# EAGLE design light (EAGLE 7.2.0)
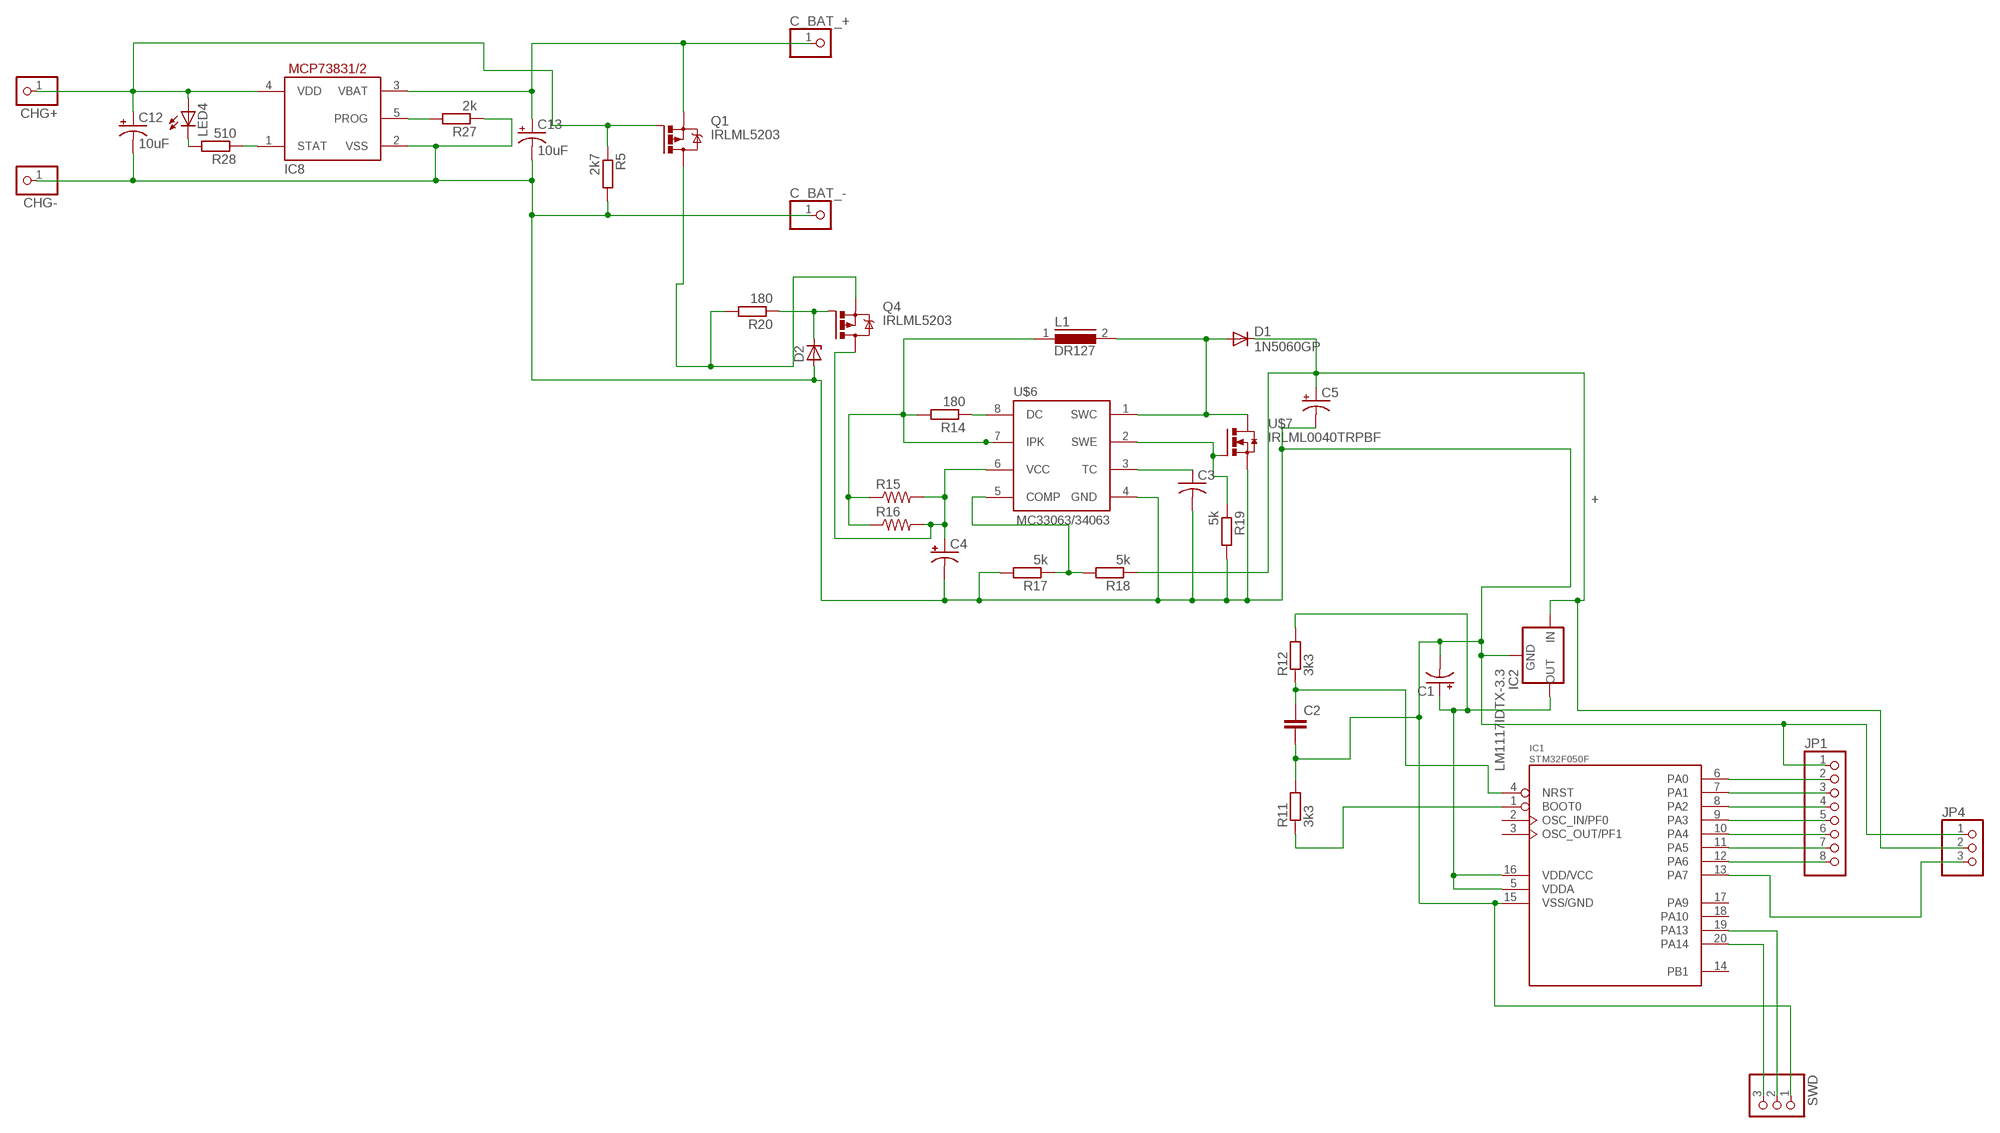
[diagram p0: schematic, sheet 1]

## Parts
C1  CPOL-USSMCD  [SMC_D]
C2  C-EUC1206  [C1206]
C3  C-US050-024X044  [C050-024X044]
C4  CPOL-USE5-8.5  [E5-8,5]
C5  CPOL-USE5-8.5  [E5-8,5]
C12  10uF  CPOL-USSMCD  [SMC_D]
C13  10uF  CPOL-USSMCD  [SMC_D]
C_BAT_+  PINHD-1X1  [1X01]
C_BAT_-  PINHD-1X1  [1X01]
CHG+  PINHD-1X1  [1X01]
CHG-  PINHD-1X1  [1X01]
D1  1N5060GP  [DO15-12]
D2  ZENER-DIODESOD80C  [SOD80C]
IC1  STM32F050F  [TSSOP20]
IC2  LM1117IDTX-3.3  [TO252]
IC8  MCP73831/OT  [SOT23-5L]
JP1  PINHD-1X8  [1X08]
JP4  PINHD-1X3  [1X03]
L1  DR127  [DR127]
LED4  LED  [SMARTLED-TTW]
Q1  IRLML5203  [MICRO3]
Q4  IRLML5203  [MICRO3]
R5  2k7  R-EU_M1206  [M1206]
R11  3k3  R-EU_M1206  [M1206]
R12  3k3  R-EU_M1206  [M1206]
R14  180  R-EU_M1206  [M1206]
R15  R-US_0207/12  [0207/12]
R16  R-US_0207/12  [0207/12]
R17  5k  R-EU_M1206  [M1206]
R18  5k  R-EU_M1206  [M1206]
R19  5k  R-EU_M1206  [M1206]
R20  180  R-EU_M1206  [M1206]
R27  2k  R-EU_M1206  [M1206]
R28  510  R-EU_M1206  [M1206]
SWD  PINHD-1X3  [1X03]
U$6  MC33063/MC34063D  [SO08]
U$7  IRLML0040TRPBF  [MICRO3]

## Nets
N$1: IC1.6(PA0) JP1.2
N$2: C1.- C2.2 C3.2 C4.- C5.- C12.- C13.- C_BAT_-.1 CHG-.1 D2.A IC1.15(VSS/GND) IC2.1(GND) IC8.2(VSS) JP1.1 JP4.1 R5.2 R11.2 R17.2 R19.2 R27.1 SWD.1 U$6.4(GND) U$7.2(S)
N$3: IC1.7(PA1) JP1.3
N$4: IC1.8(PA2) JP1.4
N$5: Q1.3(D) Q4.2(S) R20.2
N$6: IC1.9(PA3) JP1.5
N$7: IC1.10(PA4) JP1.6
N$8: IC1.11(PA5) JP1.7
N$9: IC1.12(PA6) JP1.8
N$10: IC1.13(PA7) JP4.3
N$30: L1.1 R14.2 R15.1 R16.1 U$6.7(IPK)
N$31: C2.1 IC1.4(NRST) R12.1
N$32: IC1.1(BOOT0) R11.1
N$33: D1.A L1.2 U$6.1(SWC) U$7.3(D)
N$34: IC1.19(PA13) SWD.2
N$35: IC1.20(PA14) SWD.3
N$36: R14.1 U$6.8(DC)
N$38: C4.+ Q4.3(D) R15.2 R16.2 U$6.6(VCC)
N$40: C1.+ IC1.5(VDDA) IC1.16(VDD/VCC) IC2.TAB(OUT) R12.2
N$42: C3.1 U$6.3(TC)
N$44: D2.C Q4.1(G) R20.1
N$47: R17.1 R18.2 U$6.5(COMP)
N$49: R19.1 U$6.2(SWE) U$7.1(G)
N$57: C12.+ CHG+.1 IC8.4(VDD) LED4.A@1(A) Q1.1(G) R5.1
N$66: IC8.5(PROG) R27.2
N$68: IC8.1(STAT) R28.1
N$70: LED4.C@1(C) R28.2
N$71: C13.+ C_BAT_+.1 IC8.3(VBAT) Q1.2(S)
N$73: C5.+ D1.C IC2.2(IN) JP4.2 R18.1
Unconnected: IC1.2(OSC_IN/PF0) IC1.3(OSC_OUT/PF1) IC1.14(PB1) IC1.17(PA9) IC1.18(PA10)

## Notes on the sheet
- +

## Library data of the parts
C1 C12 C13 = rcl:CPOL-US: POLARIZED CAPACITOR, American symbol
C2 = rcl:C-EU: CAPACITOR, European symbol
C3 = adafruit:C-US: CAPACITOR, American symbol
C4 C5 = adafruit:CPOL-US: POLARIZED CAPACITOR, American symbol
C_BAT_+ C_BAT_- CHG+ CHG- = adafruit:PINHD-1X1: Pin header 1x1 for 0.1" spacing With round pins
D1 = diode:1N5060GP: DIODE controlled avalanche rectifier
D2 = diode:ZENER-DIODE: Z-Diode
IC1 = STM32F050:STM32F050*: STM32F050xxF*
IC2 = lm1117:LM1117IDTX-*
IC8 = adafruit:MCP73831: MCP73831/2 Miniature Single-Cell, Fully Integrated Li-Ion, Li-Polymer Charge Management Controllers. Nice and small simple lipoly charge controller, with adjustable current and status output (LED) http://www.ladyada.net/library/pcb/eaglelibrary.html
JP1 = pinhead:PINHD-1X8: PIN HEADER
JP4 = pinhead:PINHD-1X3: PIN HEADER
L1 = inductors:DR127: High Power Density, High Efficiency, Shielded Inductors Source: coiltronics_dr_series.pdf
LED4 = adafruit:LED: LED OSRAM: - CHIPLED LG R971, LG N971, LY N971, LG Q971, LY Q971, LO R971, LY R971 LH N974, LH R974 LS Q976, LO Q976, LY Q976 LO Q996 - Hyper CHIPLED LW Q18S LB Q993, LB Q99A, LB R99A - SideLED LS A670, LO A670, LY A670, LG A670, LP A670 LB A673, LV A673, LT A673, LW A673 LH A674 LY A675 LS A676, LA A676, LO A676, LY A676, LW A676 LS A679, LY A679, LG A679 - Hyper Micro SIDELED® LS Y876, LA Y876, LO Y876, LY Y876 LT Y87S - SmartLED LW L88C, LW L88S LB L89C, LB L89S, LG L890 LS L89K, LO L89K, LY L89K LS L896, LA L896, LO L896, LY L896 - TOPLED LS T670, LO T670, LY T670, LG T670, LP T670 LSG T670, LSP T670, LSY T670, LOP T670, LYG T670 LG T671, LOG T671, LSG T671 LB T673, LV T673, LT T673, LW T673 LH T674 LS T676, LA T676, LO T676, LY T676, LB T676, LH T676, LSB T676, LW T676 LB T67C, LV T67C, LT T67C, LS T67K, LO T67K, LY T67K, LW E67C LS E67B, LA E67B, LO E67B, LY E67B, LB E67C, LV E67C, LT E67C LW T67C LS T679, LY T679, LG T679 LS T770, LO T770, LY T770, LG T770, LP T770 LB T773, LV T773, LT T773, LW T773 LH T774 LS E675, LA E675, LY E675, LS T675 LS T776, LA T776, LO T776, LY T776, LB T776 LHGB T686 LT T68C, LB T68C - Hyper Mini TOPLED® LB M676 - Mini TOPLED Santana® LG M470 LS M47K, LO M47K, LY M47K Source: http://www.osram.convergy.de/
Q1 Q4 = transistor-power:IRLML5203: HEXFET P-Channel Power MOSFET
R5 R11 R12 R14 R17-R20 R27 R28 = resistor:R-EU_: RESISTOR, European symbol
R15 R16 = adafruit:R-US_: RESISTOR, American symbol
SWD = adafruit:PINHD-1X3: PIN HEADER
U$6 = adafruit:MC33063/MC34063: MC33063 and MC34063 Basic DC/DC converter with internal power-NPN transistor, 100KHz, 1.5A peak switch current. 3-40 input/output.
U$7 = transistor-power:IRLML0040TRPBF: IRLML0040TRPbF NPN MOSFET 40 V 3.6 A

## Board
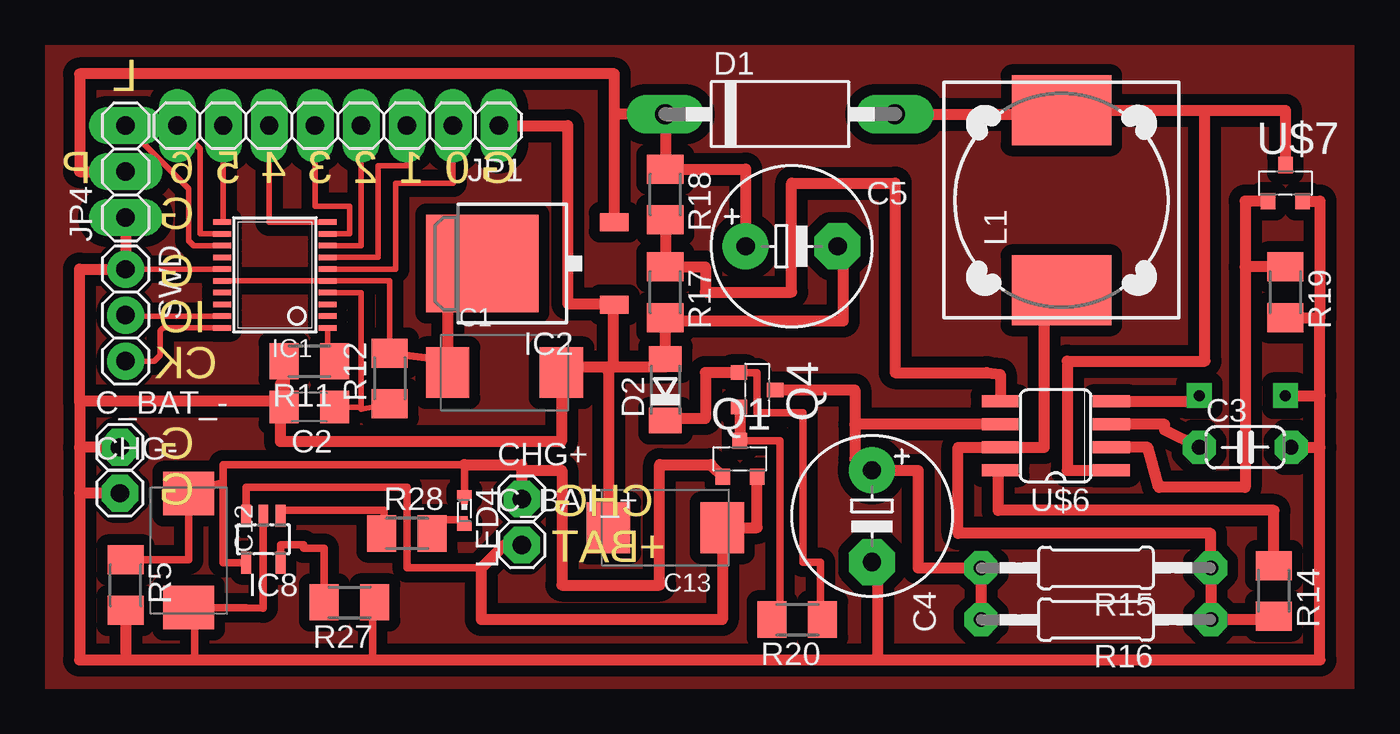
[diagram p1: board, top side]
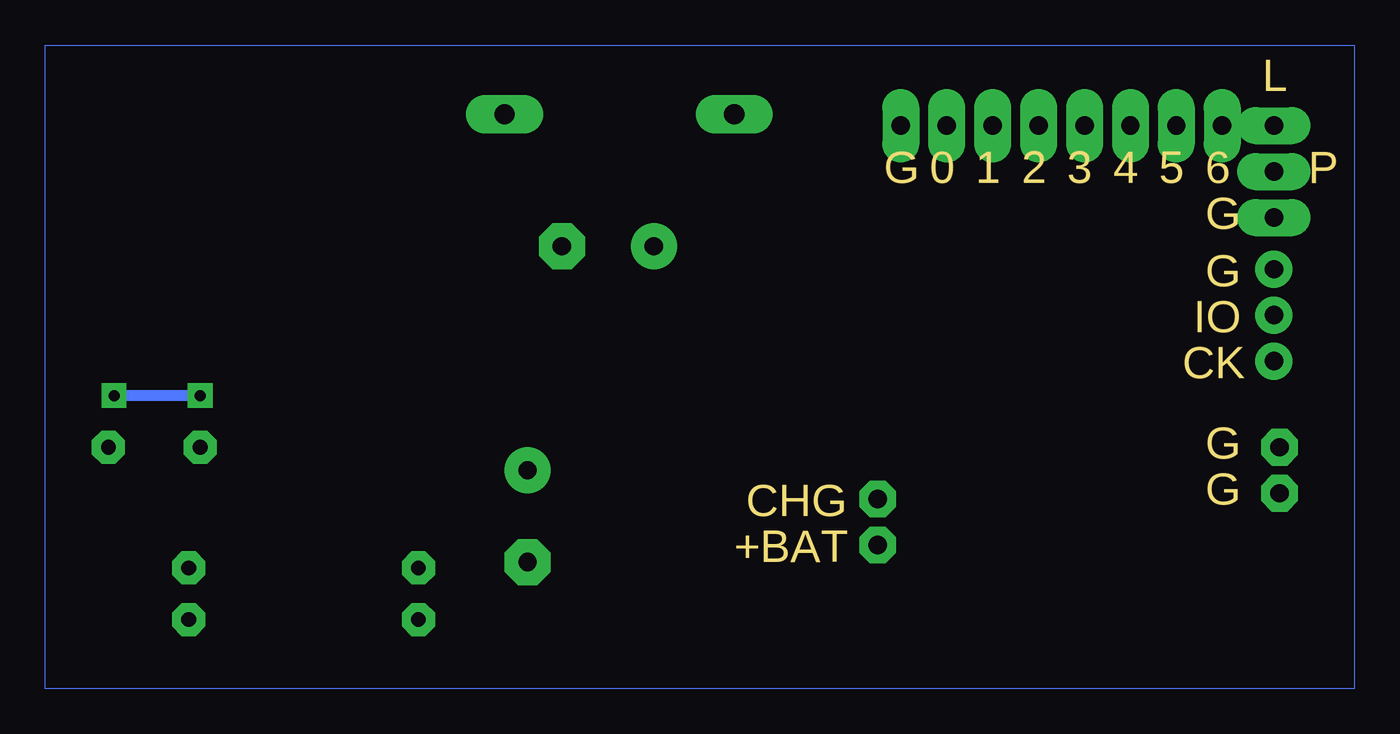
[diagram p2: board, bottom side, seen from below]

No outline drawn. Coordinates in mm, seen from the top.
Copper layers (1*16): Top 0.035mm / dielectric 1.5mm / Bottom 0.035mm
Design rules "default *": minimum track width 10mil, minimum drill 24mil, track to track 8mil, track to pad 8mil, pad to pad 8mil, via to via 8mil, smd to smd 8mil, copper to edge 40mil, drill to drill 8mil, minimum pad ring 20mil, minimum via ring 15mil, stop-mask expansion 4mil, vias tented up to drill 0mil, thermal gap 10mil

### Footprints (pad centres in the part's own frame; a part is rotated, then mirrored left to right if it is on the bottom)
SMC_D = smd 2.4 x 2.8: + -3.15,0; - 3.15,0
C1206 = smd 1.6 x 1.8: 1 -1.4,0; 2 1.4,0
C050-024X044 = drill 0.813 octagon: 1 -2.54,0; 2 2.54,0
E5-8,5 = drill 1.016 pad 2.54: + -2.54,0 | drill 1.016 pad 2.54 octagon: - 2.54,0
1X01 = drill 1.016 pad 1.93 octagon: 1 0,0
DO15-12 = drill 1.118 long: A 6.35,0; C -6.35,0
SOD80C = smd 1.4 x 1.8: A 1.7,0; C -1.7,0
TSSOP20 = smd 0.305 x 0.991: 1 -2.925,-2.918; 2 -2.275,-2.918; 3 -1.625,-2.918; 4 -0.975,-2.918; 5 -0.325,-2.918; 6 0.325,-2.918; 7 0.975,-2.918; 8 1.625,-2.918; 9 2.275,-2.918; 10 2.925,-2.918; 11 2.925,2.918; 12 2.275,2.918; 13 1.625,2.918; 14 0.975,2.918; 15 0.325,2.918; 16 -0.325,2.918; 17 -0.975,2.918; 18 -1.625,2.918; 19 -2.275,2.918; 20 -2.925,2.918
TO252 = smd 1 x 1.6: 1 -2.28,-4.8; 2 2.28,-4.8 | smd 5.4 x 6.2: TAB 0,2.5
SOT23-5L = smd 0.55 x 1.2: 1 -0.95,-1.3; 2 0,-1.3; 3 0.95,-1.3; 4 0.95,1.3; 5 -0.95,1.3
1X08 = drill 1.016 long: 1 -8.89,0; 2 -6.35,0; 3 -3.81,0; 4 -1.27,0; 5 1.27,0; 6 3.81,0; 7 6.35,0; 8 8.89,0
1X03 = drill 1.016 long: 1 -2.54,0; 2 0,0; 3 2.54,0
DR127 = smd 3.85 x 5.5: 1 -4.975,0; 2 4.975,0
SMARTLED-TTW = smd 0.8 x 0.5: A 0,-0.875; C 0,0.875 | smd 0.35 x 0.35: A@1 0,-0.5; C@1 0,0.5
MICRO3 = smd 0.8 x 0.9: 1 -0.95,-1; 2 0.95,-1; 3 0,1
M1206 = smd 1.6 x 2: 1 -1.4,0; 2 1.4,0
0207/12 = drill 0.813 pad 1.676 octagon: 1 -6.35,0; 2 6.35,0
1X03' = drill 1.016: 1 -2.54,0; 2 0,0; 3 2.54,0
SO08 = smd 0.66 x 2.032: 1 -1.905,-3.073; 2 -0.635,-3.073; 3 0.635,-3.073; 4 1.905,-3.073; 5 1.905,3.073; 6 0.635,3.073; 7 -0.635,3.073; 8 -1.905,3.073

### Placement (x,y rotation side)
C1  25.4,17.46 0 top
C2  14.61,15.56 180 top
C3  66.36,13.34 0 top
C4  45.72,9.53 270 top
C5  41.27,24.45 0 top
C12  7.94,7.62 270 top
C13  34.29,8.89 180 top
C_BAT_+  26.35,7.94 0 top
C_BAT_-  4.13,13.34 0 top
CHG+  26.35,10.48 0 top
CHG-  4.13,10.79 0 top
D1  40.64,31.75 0 top
D2  34.29,16.51 90 top
IC1  12.7,22.86 90 top
IC2  26.67,23.5 90 top
IC8  12.06,8.26 180 top
JP1  16.19,31.11 180 top
JP4  4.45,28.57 90 top
L1  56.2,26.99 90 top
LED4  23.18,9.84 180 top
Q1  38.42,12.7 0 top
Q4  39.37,16.51 270 top
R5  4.45,5.71 270 top
R11  14.61,18.1 180 top
R12  19.05,17.14 90 top
R14  67.94,5.4 270 top
R15  58.1,6.67 180 top
R16  58.1,3.81 180 top
R17  34.29,21.91 270 top
R18  34.29,27.3 270 top
R19  68.58,21.91 270 top
R20  41.59,3.81 180 top
R27  16.83,4.76 180 top
R28  20,8.57 0 top
SWD  [1X03']  4.45,20.64 270 top
U$6  55.88,13.97 90 top
U$7  68.58,27.94 0 top

### Tracks (layer width: path | path; a pad name or v marks a point on that pad's centre or on a via)
N$1
  Top 0.305: IC1.6 19.37,23.18 19.37,27.94 22.54,27.94 JP1.2
N$2  (via drill 0.6)
  Top 0.305: IC1.15 SWD.1 | R11.2 13.21,16.83 C2.2
  Top 0.406: IC8.2 12.06,4.45 11.11,4.47 C12.- 7.3,5.27 8.26,4.32 8.26,1.59 | R27.1 18.1,4.63 18.1,1.59
  Top 0.61: 31.43,17.78 28.55,17.78 C1.- 28.55,13.65 13.02,13.65 13.02,16.83 13.21,16.83 | 31.43,17.78 31.43,21.21 IC2.1 31.47,21.27 28.89,21.27 28.89,31.11 JP1.1 | 31.43,17.78 34.29,17.78 D2.A R17.2 34.29,20.32 44.13,20.32 44.13,24.45 C5.- | 31.43,17.78 arc90 31.14,17.49 C13.- | R11.2 13.21,15.88 1.91,15.88 | 1.91,15.88 1.91,23.18 SWD.1 JP4.1 | 1.91,15.88 1.91,13.34 | 1.91,13.34 1.91,10.79 | 1.91,10.79 1.91,1.59 4.45,1.59 | 4.45,1.59 8.26,1.59 18.1,1.59 46.04,1.59 | 46.04,1.59 46.04,7.62 C4.- | R5.2 4.45,1.59 | 46.04,1.59 70.48,1.59 70.48,13.34 | 70.48,13.34 70.48,16.19 | 70.48,16.19 70.48,20.51 | C_BAT_-.1 1.91,13.34 | CHG-.1 1.91,10.79 | C3.2 70.48,13.34 | R19.2 70.48,20.51 | v68.58,16.19 70.48,16.19 | U$6.4 63.82,15.88 v63.82,16.19 | U$7.2 70.48,26.94 70.48,20.51
  Bottom 0.61: v63.82,16.19 v68.58,16.19
N$3
  Top 0.305: IC1.7 18.41,23.84 18.41,28.89 20,28.89 JP1.3
N$4
  Top 0.305: IC1.8 17.46,24.48 JP1.4
N$5
  Top 0.406: Q1.3 40.64,13.7 40.64,3.49 40.19,3.49 R20.2
  Top 0.61: Q4.2 38.42,15.56 Q1.3
N$6
  Top 0.305: IC1.9 16.83,25.14 16.83,26.67 14.92,26.67 JP1.5
N$7
  Top 0.305: IC1.10 12.38,25.79 JP1.6
N$8
  Top 0.305: IC1.11 9.84,25.79 JP1.7
N$9
  Top 0.305: IC1.12 8.57,25.14 8.57,29.84 JP1.8
N$10
  Top 0.305: JP4.3 7.94,27.62 7.94,24.77 8.22,24.48 IC1.13
N$11
  pour Top (isolate 0.61): 0,0 72.39,0 72.39,35.56 0,35.56
N$12
  Bottom 0: 0,0 72.39,0 72.39,35.56 0,35.56 0,0
N$30
  Top 0.61: R14.2 67.94,3.81 R16.1 R15.1 64.45,8.57 50.48,8.57 50.48,13.34 U$6.7 55.24,13.34 55.24,21.27 56.52,21.27 | 57.15,21.27 56.52,21.27 | 56.52,21.27 L1.1
N$31
  Top 0.305: IC1.4 17.46,21.89 17.46,15.56 | 17.46,15.56 C2.1 | R12.1 17.46,15.43 17.46,15.56
N$32
  Top 0.305: IC1.1 15.62,18.48 R11.1
N$33
  Top 0.61: D1.A 56.52,31.75 L1.2 64.14,31.96 | 64.14,31.96 68.58,31.96 U$7.3 | U$6.1 56.52,12.06 56.52,18.1 64.14,18.1 64.14,31.96
N$34
  Top 0.305: SWD.2 4.5,20.59 IC1.19
N$35
  Top 0.305: IC1.20 6.6,19.93 arc90 6.35,19.68 6.35,18.41 6.03,18.1 SWD.3
N$36
  Top 0.61: R14.1 67.94,9.84 52.7,9.84 52.7,12.06 U$6.8
N$38
  Top 0.61: R16.2 R15.2 48.26,6.67 48.26,12.06 C4.+ 44.77,12.7 44.77,14.61 | Q4.3 44.77,16.51 44.77,14.61 | U$6.6 44.77,14.61
N$40
  Top 0.305: IC1.16 IC1.5 19.05,22.54 R12.2
  Top 0.406: C1.+ 21.48,18.23 R12.2
  Top 0.61: IC2.TAB 22.25,21.57 C1.+
N$42
  Top 0.61: C3.1 61.91,14.29 61.91,14.61 U$6.3
N$44
  Top 0.406: R20.1 42.86,3.81 42.86,6.99 41.91,6.99 41.91,15.24 39.37,15.24 39.37,17.46 Q4.1
  Top 0.61: Q4.1 36.51,17.46 36.51,14.92 34.29,14.92 D2.C
N$47
  Top 0.61: R18.2 R17.1 36.51,23.31 36.51,21.91 41.27,21.91 41.27,27.94 46.99,27.94 46.99,17.46 52.07,17.46 52.81,17.36 U$6.5
N$49
  Top 0.61: 66.36,23.31 66.36,11.11 61.59,11.11 60.96,13.34 U$6.2 | R19.1 66.36,23.31 | U$7.1 66.36,26.94 66.36,23.31
N$57
  Top 0.406: IC8.4 9.84,6.96 9.84,11.4 | 9.84,11.4 9.84,12.38 23.18,12.38 LED4.A@1 | R5.1 7.94,7.12 C12.+ 9.84,11.4 | 26.35,12.06 26.35,11.75
  Top 0.61: Q1.1 36.83,12.34 36.83,12.38 33.97,12.38 33.97,5.71 28.57,5.71 28.57,12.06 26.35,12.06 | 23.18,12.38 26.35,12.38 26.35,11.75 CHG+.1
N$66
  Top 0.406: IC8.5 13.02,7.94 14.29,7.94 14.29,7.75 15.43,7.75 R27.2
N$68
  Top 0.406: IC8.1 13.02,9.84 18.73,9.84 18.73,9.21 R28.1
N$70
  Top 0.406: R28.2 21.4,9.34 LED4.C@1
N$71
  Top 0.406: IC8.3 11.12,11.11 20,11.11 20,6.67 24.13,6.67
  Top 0.61: Q1.2 39.37,8.89 C13.+ 37.44,3.81 24.13,3.81 24.13,6.67 25.4,7.94 C_BAT_+.1
N$73
  Top 0.61: IC2.2 31.47,31.75 | 31.47,31.75 31.47,33.97 1.91,33.97 1.91,28.57 JP4.2 | 31.47,31.75 D1.C R18.1 38.73,28.7 C5.+

### Text on the board
Dimension: L | P | 6 | 5 | 4 | 3 | 2 | 1 | 0 | G | G | G | IO | CK | G | G | CHG | +BAT